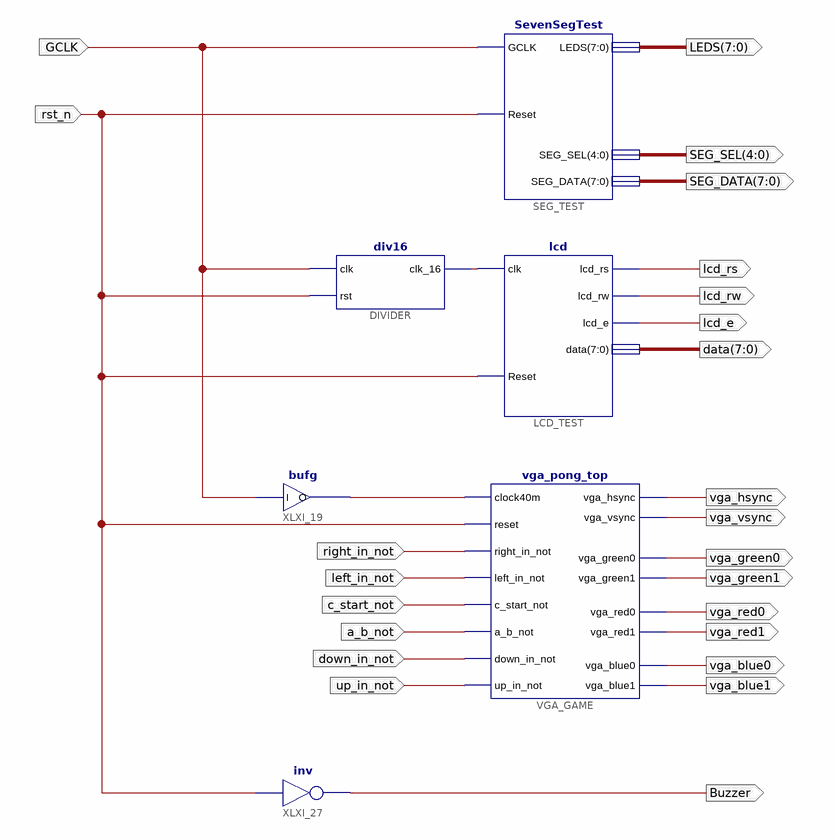
[diagram p0: schematic sheet 1]
// Xilinx ISE schematic lcd_top.sch (spartan3) as structural Verilog: 6 symbols, 24 ports
module lcd_top (
  input  GCLK,
  input  rst_n,
  input  right_in_not,
  input  left_in_not,
  input  c_start_not,
  input  a_b_not,
  input  down_in_not,
  input  up_in_not,
  output lcd_rw,
  output lcd_e,
  output [7:0] data,
  output lcd_rs,
  output [7:0] LEDS,
  output [4:0] SEG_SEL,
  output [7:0] SEG_DATA,
  output vga_hsync,
  output vga_vsync,
  output vga_green0,
  output vga_green1,
  output vga_red0,
  output vga_red1,
  output vga_blue0,
  output vga_blue1,
  output Buzzer
);

  wire XLXN_3, XLXN_20;

  SevenSegTest SEG_TEST (.GCLK(GCLK), .LEDS(LEDS), .SEG_SEL(SEG_SEL), .SEG_DATA(SEG_DATA), .Reset(rst_n));
  bufg XLXI_19 (.I(GCLK), .O(XLXN_20));
  lcd LCD_TEST (.clk(XLXN_3), .Reset(rst_n), .lcd_rs(lcd_rs), .lcd_rw(lcd_rw), .lcd_e(lcd_e), .data(data));
  vga_pong_top VGA_GAME (
    .clock40m(XLXN_20), .reset(rst_n), .right_in_not(right_in_not), .left_in_not(left_in_not),
    .c_start_not(c_start_not), .a_b_not(a_b_not), .down_in_not(down_in_not), .up_in_not(up_in_not),
    .vga_hsync(vga_hsync), .vga_red1(vga_red1), .vga_blue1(vga_blue1), .vga_blue0(vga_blue0),
    .vga_red0(vga_red0), .vga_vsync(vga_vsync), .vga_green1(vga_green1), .vga_green0(vga_green0));
  div16 DIVIDER (.clk(GCLK), .rst(rst_n), .clk_16(XLXN_3));
  not XLXI_27 (Buzzer, rst_n);
endmodule
